# EAGLE design micromouse2019_bt (EAGLE 9.3.1)
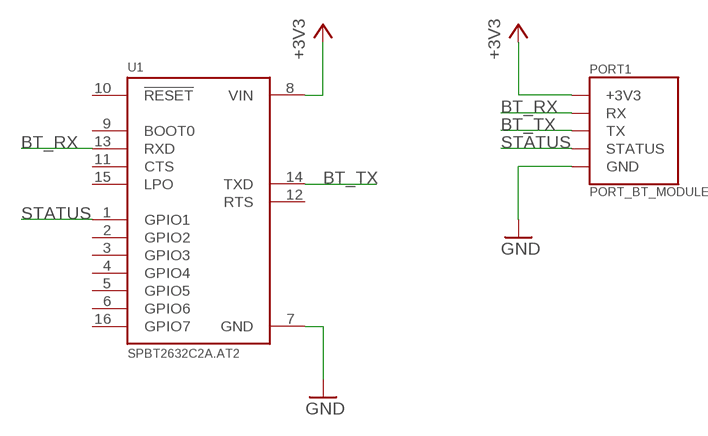
[diagram p0: schematic, sheet 1]

## Parts
PORT1  PORT_BT_MODULE  [BT_PORT_MODULE]
U1  SPBT2632C2A.AT2  [XCVR_SPBT2632C2A.AT2]

## Nets
+3V3: PORT1.P15(+3V3) U1.8(VIN)
BT_RX: PORT1.P9(RX) U1.13(RXD)
BT_TX: PORT1.P8(TX) U1.14(TXD)
GND: PORT1.P14(GND) U1.7(GND)
STATUS: PORT1.P11(STATUS) U1.1(GPIO1)
Unconnected: U1.2(GPIO2) U1.3(GPIO3) U1.4(GPIO4) U1.5(GPIO5) U1.6(GPIO6) U1.9(BOOT0) U1.10(!RESET) U1.11(CTS) U1.12(RTS) U1.15(LPO) U1.16(GPIO7)

## Library data of the parts
PORT1 = 0-micromouse2019:PORT_BT: Port between mouse pcb and bluetooth module
U1 = 0-micromouse2019:SPBT2632C2A.AT2: Bluetooth V3.0 module class 2 with antenna, supporting SPP and iAP with AT2 command set; AVAILABILITY: Unavailable; DESCRIPTION: Bluetooth V3.0 module class 2 with antenna, supporting SPP and iAP with AT2 command set; MF: STMicroelectronics; MP: SPBT2632C2A.AT2; PACKAGE: Module STMicroelectronics; PRICE: None

## Board
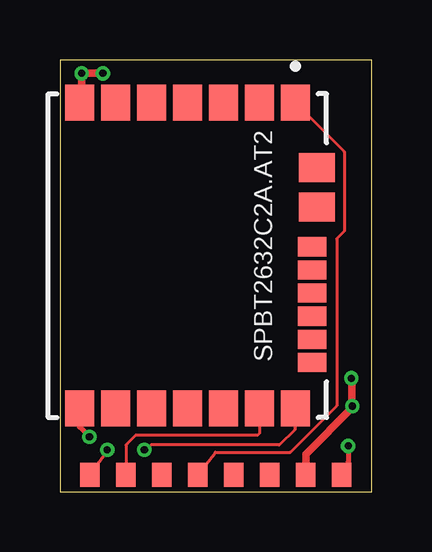
[diagram p1: board, top side]
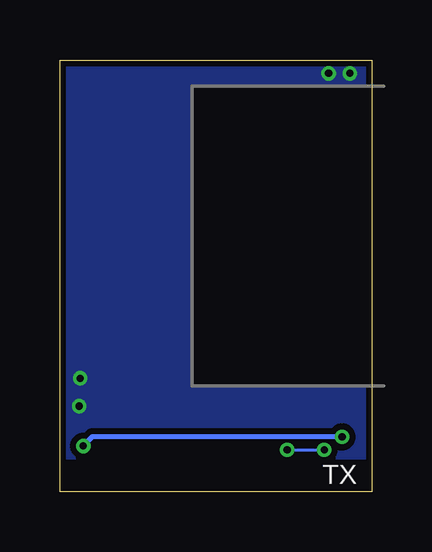
[diagram p2: board, bottom side, seen from below]

Size 13 x 18 mm. Coordinates in mm from the lower left corner, seen from the top.
Outline: 0,0 13,0 13,18 0,18 0,0
Copper layers (1*16): Top 0.035mm / dielectric 1.5mm / Bottom 0.035mm
Design rules "JLC_PCB_design_rules": minimum track width 5mil, minimum drill 0.2mm, track to track 5mil, track to pad 5mil, pad to pad 5mil, via to via 5mil, smd to smd 5mil, copper to edge 0.2mm, drill to drill 5mil, minimum pad ring 3mil, minimum via ring 3mil, stop-mask expansion 4mil, vias tented up to drill 0mil, thermal gap 10mil

### Footprints (pad centres in the part's own frame; a part is rotated, then mirrored left to right if it is on the bottom)
BT_PORT_MODULE = smd 0.8 x 1: P8 -5.25,0; P9 -3.75,0; P10 -2.25,0; P11 -0.75,0; P12 0.75,0; P13 2.25,0; P14 3.75,0; P15 5.25,0
XCVR_SPBT2632C2A.AT2 = smd 1.5 x 1.2: 1 -6.37,4.5; 2 -6.37,3; 3 -6.37,1.5; 4 -6.37,0; 5 -6.37,-1.5; 6 -6.37,-3; 7 -6.37,-4.5; 8 6.37,-4.5; 9 6.37,-3; 10 6.37,-1.5; 11 6.37,0; 12 6.37,1.5; 13 6.37,3; 14 6.37,4.5 | smd 1.2 x 1.5: 15 -2.02,5.4; 16 -3.67,5.4 | smd 0.8 x 1.2: 17 -0.37,5.2; 18 0.595,5.2; 19 1.56,5.2; 20 2.525,5.2; 21 3.49,5.2; 22 4.455,5.2

### Placement (x,y rotation side)
PORT1  6.5,0.7 0 top
U1  5.32,9.84 270 top

### Tracks (layer width: path | path; a pad name or v marks a point on that pad's centre or on a via)
+3V3  (via drill 0.3 pad 0.6)
  Top 0.203: U1.8 0.82,2.69 v1.23,2.28 | v12.03,1.9 12.03,1.23 PORT1.P15
  Bottom 0.203: v1.23,2.28 11.65,2.28 v12.03,1.9
BT_RX
  Top 0.127: U1.13 8.32,2.43 8.25,2.35 3.16,2.35 2.75,1.94 PORT1.P9
BT_TX  (via drill 0.3 pad 0.6)
  Top 0.127: U1.14 9.79,3.44 9.79,2.58 9.15,1.94 3.8,1.94 3.59,1.74 v3.52,1.74 | v1.97,1.74 1.97,1.67 PORT1.P8
  Bottom 0.127: v3.52,1.74 v1.97,1.74
GND  (via drill 0.3 pad 0.6)
  Top 0.152: v12.16,4.72 12.18,4.7
  Top 0.305: PORT1.P14 10.25,1.56 12.18,3.49 12.18,4.7 | v1.79,17.44 v0.91,17.44 0.91,16.29
  Top 0.406: 0.91,16.29 U1.7
  other vias: 12.2,3.56
  pour Bottom (isolate 0.254): 0,17.9 0,16.9 7.5,16.9 7.5,4.4 0,4.4 0,1.4 13,1.4 13,17.9
STATUS
  Top 0.127: U1.1 11.86,14.17 11.86,10.86 11.55,10.55 11.55,3.58 9.61,1.64 6.48,1.64 PORT1.P11

### Text on the board
tDocu: copper free zone